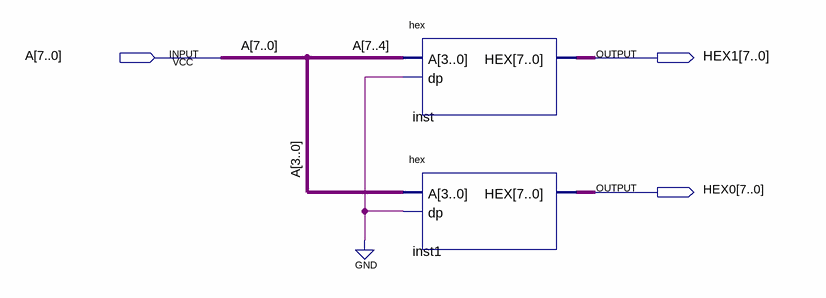
[diagram p0: schematic sheet]
// Quartus schematic hex2.bdf as structural Verilog: 2 symbols, 3 pins
module hex2 (
  input  [7:0] A,
  output [7:0] HEX1,
  output [7:0] HEX0
);

  hex inst (.A(A[7:4]), .dp(1'b0), .HEX(HEX1));
  hex inst1 (.A(A[3:0]), .dp(1'b0), .HEX(HEX0));
endmodule
